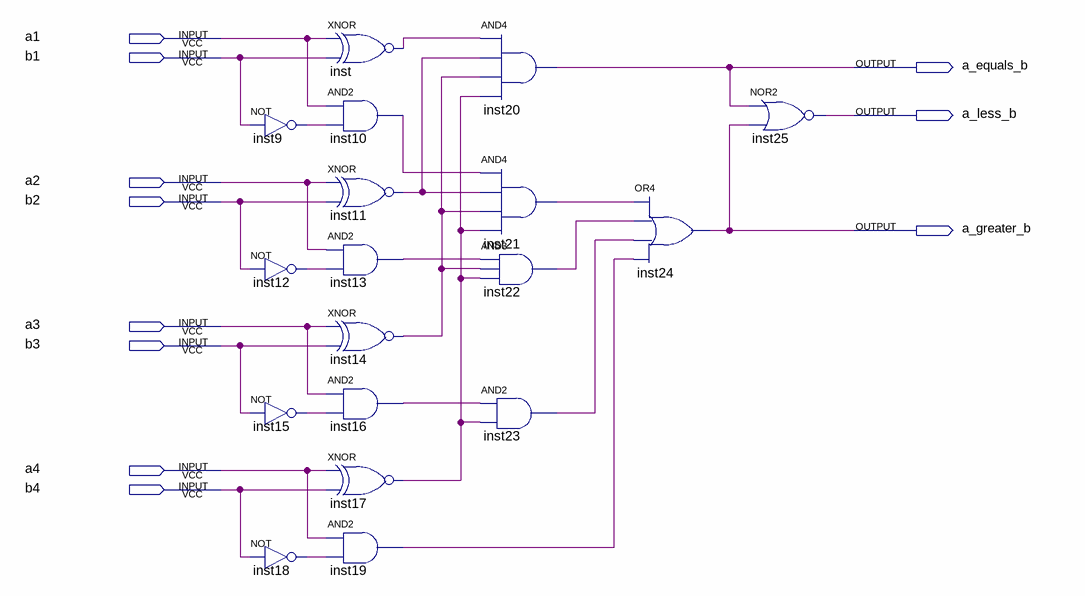
[diagram p0: schematic sheet]
// Quartus schematic LabWork1.bdf as structural Verilog: 18 symbols, 11 pins
module LabWork1 (
  input  a1,
  input  b1,
  input  a2,
  input  b2,
  input  a3,
  input  b3,
  input  a4,
  input  b4,
  output a_equals_b,
  output a_less_b,
  output a_greater_b
);

  wire inst9_out, inst10_out, inst11_out, inst12_out, inst13_out, inst14_out, inst15_out, inst16_out,
       inst17_out, inst18_out, inst19_out, inst21_out, inst22_out, inst23_out, inst_out;

  not inst9 (inst9_out, b1);
  not inst12 (inst12_out, b2);
  not inst15 (inst15_out, b3);
  not inst18 (inst18_out, b4);
  xnor inst (inst_out, a1, b1);
  and inst10 (inst10_out, a1, inst9_out);
  xnor inst11 (inst11_out, a2, b2);
  and inst13 (inst13_out, a2, inst12_out);
  xnor inst14 (inst14_out, a3, b3);
  and inst16 (inst16_out, a3, inst15_out);
  xnor inst17 (inst17_out, a4, b4);
  and inst19 (inst19_out, a4, inst18_out);
  and inst20 (a_equals_b, inst_out, inst11_out, inst14_out, inst17_out);
  and inst21 (inst21_out, inst10_out, inst11_out, inst14_out, inst17_out);
  and inst22 (inst22_out, inst13_out, inst14_out, inst17_out);
  and inst23 (inst23_out, inst16_out, inst17_out);
  or inst24 (a_greater_b, inst21_out, inst22_out, inst23_out, inst19_out);
  nor inst25 (a_less_b, a_equals_b, a_greater_b);
endmodule
